# EAGLE schematic Double Socket (EAGLE 7.4.0)
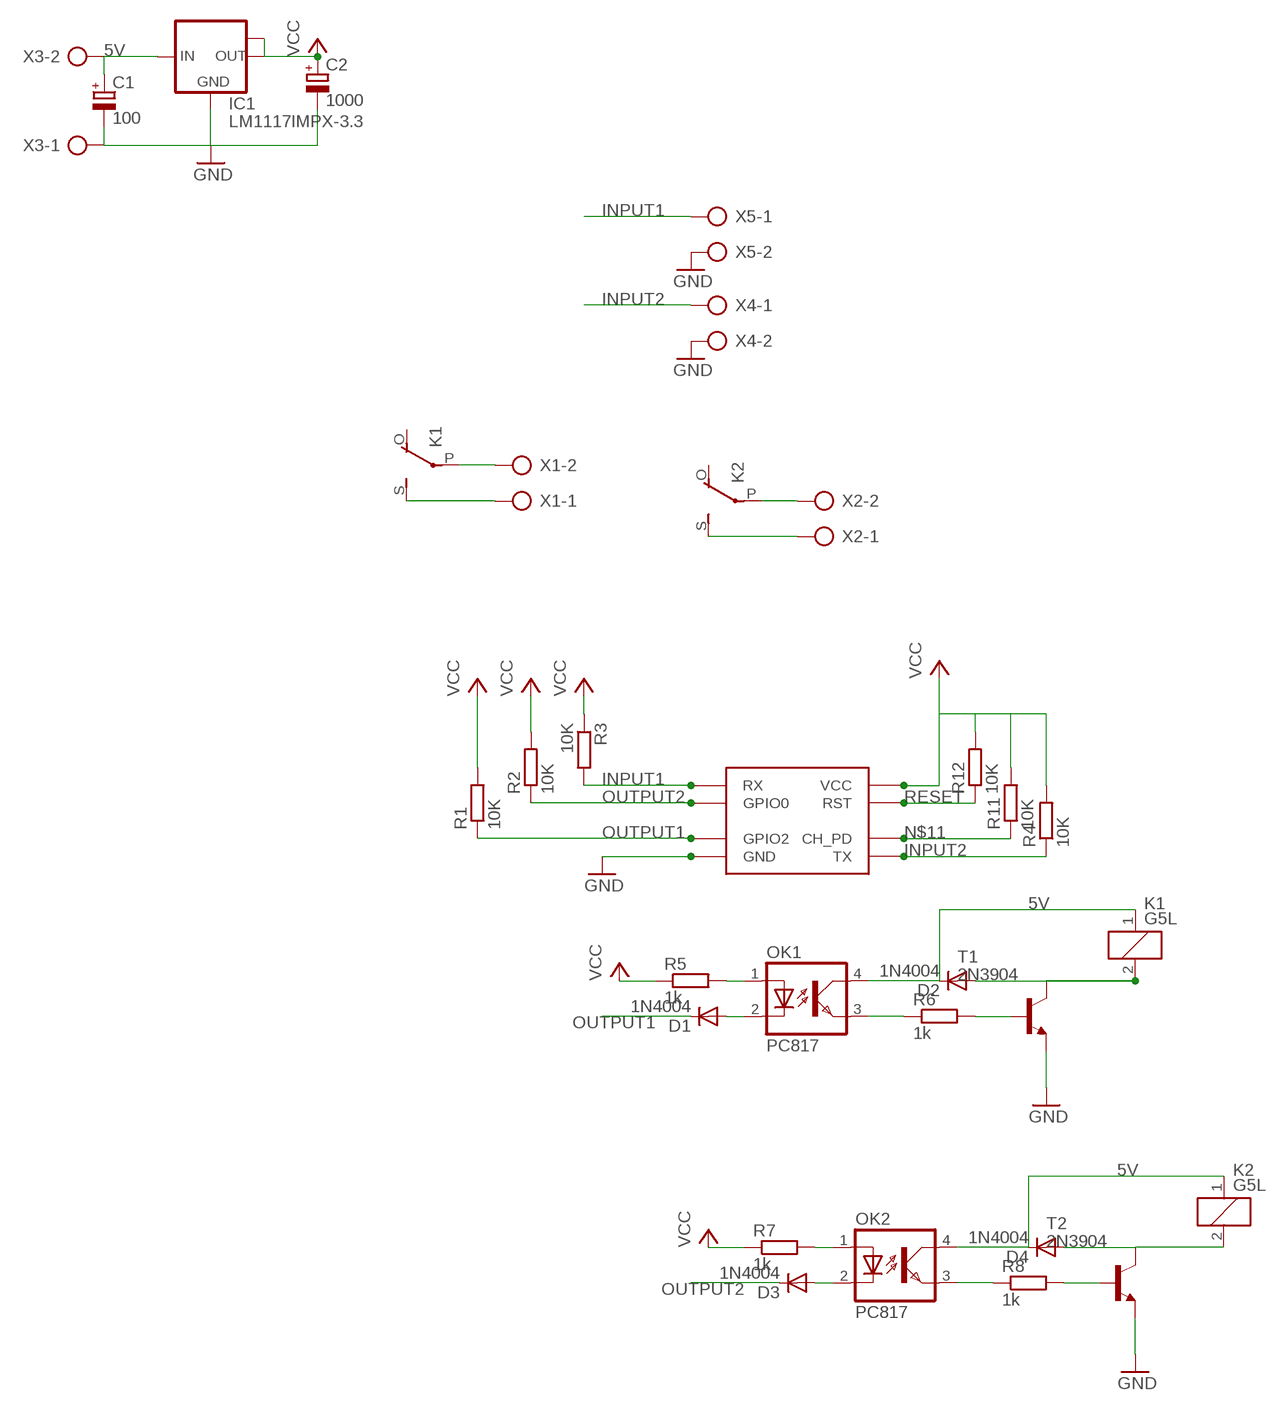
[diagram p0: schematic, sheet 1]

## Parts
C1  100  CPOL-EUE5-10.5  [E5-10,5]
C2  1000  CPOL-EUE5-10.5  [E5-10,5]
D1  1N4004  [DO41-10]
D2  1N4004  [DO41-10]
D3  1N4004  [DO41-10]
D4  1N4004  [DO41-10]
IC1  LM1117IMPX-3.3  [SOT223]
K1  G5L  [G5LE]
K2  G5L  [G5LE]
OK1  PC817  [DIL04]
OK2  PC817  [DIL04]
R1  10K  R-EU_M0805  [M0805]
R2  10K  R-EU_M0805  [M0805]
R3  10K  R-EU_M0805  [M0805]
R4  10K  R-EU_M0805  [M0805]
R5  1k  R-EU_M0805  [M0805]
R6  1k  R-EU_M0805  [M0805]
R7  1k  R-EU_M0805  [M0805]
R8  1k  R-EU_M0805  [M0805]
R11  10K  R-EU_M0805  [M0805]
R12  10K  R-EU_M0805  [M0805]
T1  2N3904  [TO92]
T2  2N3904  [TO92]
U$2  ESP8266  [ESP8266]
X1  AK500/2-H  [AK500/2-H]
X2  AK500/2-H  [AK500/2-H]
X3  AK500/2-H  [AK500/2-H]
X4  AK500/2-H  [AK500/2-H]
X5  AK500/2-H  [AK500/2-H]

## Nets
5V: C1.+ D2.C D4.C IC1.3(IN) K1.1 K2.1 OK1.4(COL) OK2.4(COL) X3.2
GND: C1.- C2.- IC1.1(GND) T1.3(E) T2.3(E) U$2.GND X3.1 X4.2 X5.2
INPUT1: R3.2 U$2.RX X5.1
INPUT2: R4.1 U$2.TX X4.1
N$1: K1.P(2:P) X1.2
N$2: K1.S(2:S) X1.1
N$3: OK1.1(A) R5.2
N$4: OK1.3(EMIT) R6.1
N$5: D1.A OK1.2(C)
N$6: OK2.1(A) R7.2
N$7: R6.2 T1.2(B)
N$8: D2.A K1.2 T1.1(C)
N$9: OK2.3(EMIT) R8.1
N$10: D3.A OK2.2(C)
N$11: R11.1 U$2.CH_PD
N$12: R8.2 T2.2(B)
N$13: D4.A K2.2 T2.1(C)
N$14: K2.S(2:S) X2.1
N$15: K2.P(2:P) X2.2
OUTPUT1: D1.C R1.1 U$2.GPIO2
OUTPUT2: D3.C R2.1 U$2.GPIO0
RESET: R12.1 U$2.RST
VCC: C2.+ IC1.2(OUT) IC1.TAB(OUT1) R1.2 R2.2 R3.1 R4.2 R5.1 R7.1 R11.2 R12.2 U$2.VCC
Unconnected: K1.O(2:O) K2.O(2:O)

## Library data of the parts
C1 C2 = rcl:CPOL-EU: POLARIZED CAPACITOR, European symbol
D1-D4 = diode:1N4004: DIODE general purpose rectifier, 1 A
IC1 = lm1117:LM1117IMPX-*
K1 K2 = relay:G5L: RELAY 1 x switch, 10 A/120 V AC, 8 A/30 V ADC, Omron; OC_FARNELL: unknown; OC_NEWARK: unknown
OK1 OK2 = optocoupler:PC817: SHARP OPTO COUPLER; MPN: PC817X4J000F; OC_FARNELL: 9707727; OC_NEWARK: 97K7059
R1-R8 R11 R12 = rcl:R-EU_: RESISTOR, European symbol
T1 T2 = transistor:2N3904: NPN TRANSISTOR
U$2 = Andre:ESP8266
X1-X5 = con-ptr500:AK500/2-H: CONNECTOR Aug. 2004 / PTR Meßtechnik: Die Bezeichnung der Serie AK505 wurde geändert. Es handelt sich hierbei um AK500 in horizontaler Ausführung.